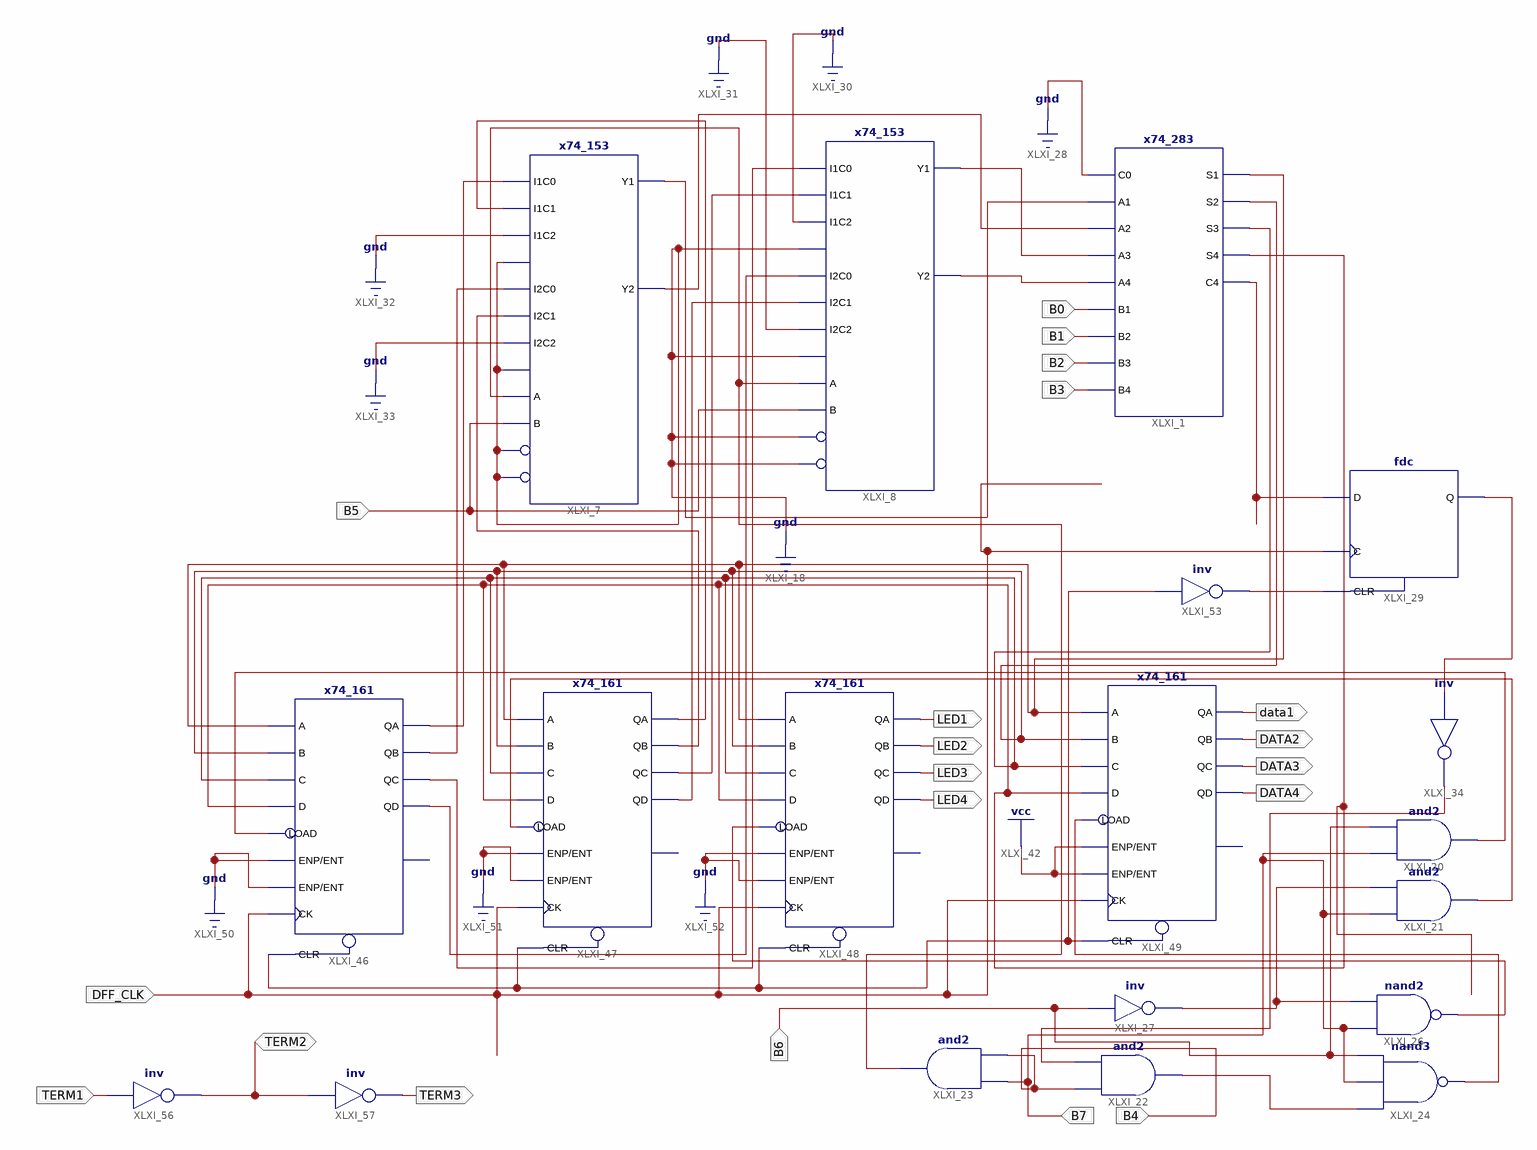
[diagram p0: schematic sheet 1]
// Xilinx ISE schematic FOURBIT.sch (xc9500xl) as structural Verilog: 19 symbols, 20 ports
module FOURBIT (
  input  B0,
  input  B1,
  input  B2,
  input  B3,
  input  B5,
  input  B4,
  input  B7,
  input  B6,
  input  DFF_CLK,
  input  TERM1,
  inout  TERM2,
  output LED1,
  output LED2,
  output LED3,
  output LED4,
  output data1,
  output DATA2,
  output DATA3,
  output DATA4,
  output TERM3
);

  wire DFF_D, XLXN_10, XLXN_51, XLXN_54, XLXN_57, XLXN_58, XLXN_60, XLXN_61, XLXN_62, XLXN_63, XLXN_64,
       XLXN_65, XLXN_66, XLXN_84, XLXN_85, XLXN_86, XLXN_87, XLXN_103, XLXN_113, XLXN_115, XLXN_124,
       XLXN_125, XLXN_136, XLXN_137, XLXN_138, XLXN_139, XLXN_140, XLXN_142;

  x74_283 XLXI_1 (
    .A1(XLXN_84), .A2(XLXN_85), .A3(XLXN_86), .A4(XLXN_87), .B1(B0), .B2(B1), .B3(B2), .B4(B3), .C0(1'b0),
    .C4(DFF_D), .S1(XLXN_51), .S2(XLXN_10), .S3(XLXN_54), .S4(XLXN_57));
  x74_153 XLXI_7 (
    .A(XLXN_103), .B(B5), .G1(1'b0), .G2(1'b0), .I1C0(XLXN_58), .I1C1(XLXN_60), .I1C2(1'b0), .I1C3(1'b0),
    .I2C0(XLXN_61), .I2C1(XLXN_64), .I2C2(1'b0), .I2C3(1'b0), .Y1(XLXN_84), .Y2(XLXN_85));
  x74_153 XLXI_8 (
    .A(XLXN_103), .B(B5), .G1(1'b0), .G2(1'b0), .I1C0(XLXN_62), .I1C1(XLXN_65), .I1C2(1'b0), .I1C3(1'b0),
    .I2C0(XLXN_63), .I2C1(XLXN_66), .I2C2(1'b0), .I2C3(1'b0), .Y1(XLXN_86), .Y2(XLXN_87));
  and XLXI_20 (XLXN_136, B7, B6);
  and XLXI_21 (XLXN_137, B7, XLXN_113);
  and XLXI_22 (XLXN_115, B4, XLXN_124);
  and XLXI_23 (XLXN_103, B4, B7);
  nand XLXI_24 (XLXN_139, XLXN_115, B7, B6);
  nand XLXI_26 (XLXN_138, B7, XLXN_113);
  not XLXI_27 (XLXN_113, B6);
  fdc XLXI_29 (.C(DFF_CLK), .CLR(XLXN_140), .D(DFF_D), .Q(XLXN_125));
  not XLXI_34 (XLXN_124, XLXN_125);
  x74_161 XLXI_46 (
    .A(XLXN_51), .B(XLXN_10), .C(XLXN_54), .CK(DFF_CLK), .CLR(XLXN_142), .D(XLXN_57), .ENP(1'b0), .ENT(1'b0),
    .LOAD(XLXN_136), .QA(XLXN_58), .QB(XLXN_61), .QC(XLXN_62), .QD(XLXN_63));  // open: RCO
  x74_161 XLXI_47 (
    .A(XLXN_51), .B(XLXN_10), .C(XLXN_54), .CK(DFF_CLK), .CLR(XLXN_142), .D(XLXN_57), .ENP(1'b0), .ENT(1'b0),
    .LOAD(XLXN_137), .QA(XLXN_60), .QB(XLXN_64), .QC(XLXN_65), .QD(XLXN_66));  // open: RCO
  x74_161 XLXI_48 (
    .A(XLXN_51), .B(XLXN_10), .C(XLXN_54), .CK(DFF_CLK), .CLR(XLXN_142), .D(XLXN_57), .ENP(1'b0), .ENT(1'b0),
    .LOAD(XLXN_138), .QA(LED1), .QB(LED2), .QC(LED3), .QD(LED4));  // open: RCO
  x74_161 XLXI_49 (
    .A(XLXN_51), .B(XLXN_10), .C(XLXN_54), .CK(DFF_CLK), .CLR(XLXN_142), .D(XLXN_57), .ENP(1'b1), .ENT(1'b1),
    .LOAD(XLXN_139), .QA(data1), .QB(DATA2), .QC(DATA3), .QD(DATA4));  // open: RCO
  not XLXI_53 (XLXN_140, XLXN_142);
  not XLXI_56 (TERM2, TERM1);
  not XLXI_57 (TERM3, TERM2);
endmodule
